# EAGLE schematic people_counter_v2 (EAGLE 9.6.2)

## Sheet 1 of 2
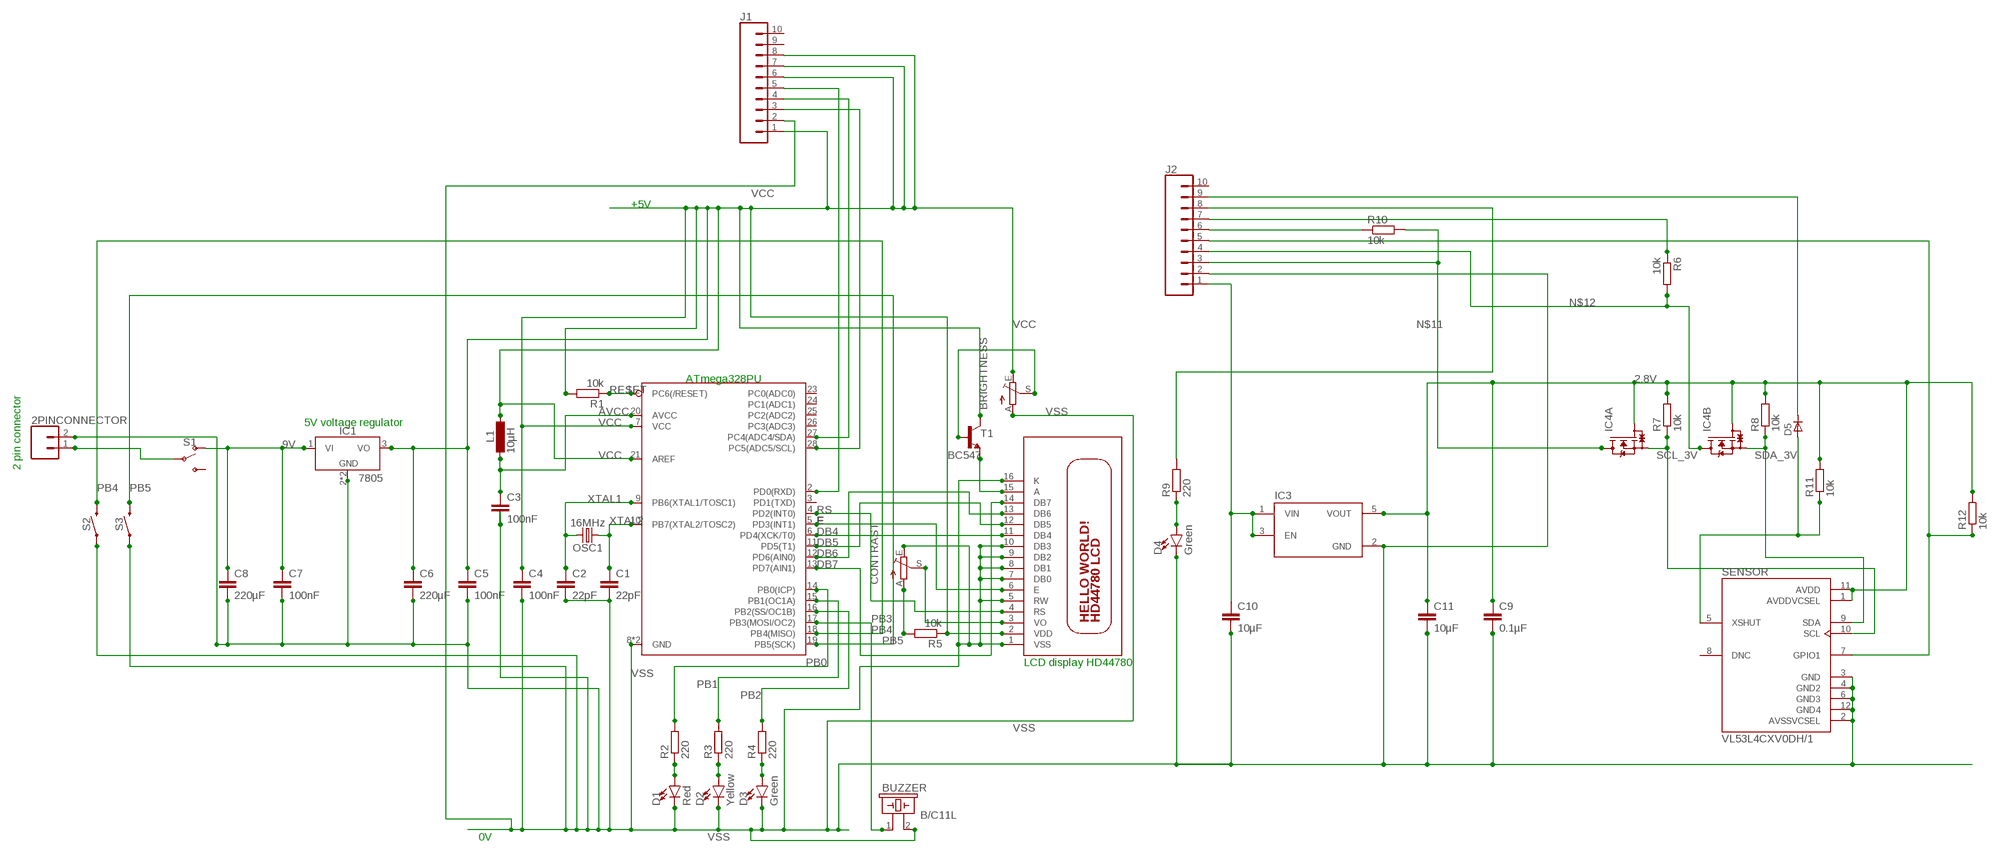
[diagram p0: schematic, sheet 1]

### Parts
2PINCONNECTOR  CONN_02  [1X02]
BRIGHTNESS  TRIM_EU-PT10S  [PT-10S]
BUZZER  B/C11L  [B/C11L]
C1  22pF  C-EUC0805  [C0805]
C2  22pF  C-EUC0805  [C0805]
C3  100nF  C-EUC0805  [C0805]
C4  100nF  C-EUC0805  [C0805]
C5  100nF  C-EUC0805  [C0805]
C6  220µF  C-EUC0805  [C0805]
C7  100nF  C-EUC0805  [C0805]
C8  220µF  C-EUC0805  [C0805]
C9  0.1µF  C-EUC0805  [C0805]
C10  10µF  C-EUC0805  [C0805]
C11  10µF  C-EUC0805  [C0805]
CONTRAST  TRIM_EU-PT10S  [PT-10S]
D1  Red  LED-RED-0603-WE  [LED-0603]
D2  Yellow  LED-YELLOW-0603-WE  [LED-0603]
D3  Green  LED-GREEN-0603-WE  [LED-0603]
D4  Green  LED-GREEN-0603-WE  [LED-0603]
D5  1N4148WS  [SOD323F]
IC1  7805  LM7805_SOT223  [SOT230P700X170-4]
IC2  328P  ATMEGA328P_PDIP  [DIP28]
IC3  MIC5504-2.8YM5-TR  [SOT95P280X145-5N]
IC4  DMN63D8LDW-7  [SOT363]
J1  CONN_10"  [1X10]
J2  CONN_10"  [1X10]
L1  10µH  L-EUL1812  [L1812]
OSC1  16MHz  CRYSTAL-16MHZPTH-HC49US  [HC49US]
R1  10k  R-EU_R0603  [R0603]
R2  220  R-EU_R0603  [R0603]
R3  220  R-EU_R0603  [R0603]
R4  220  R-EU_R0603  [R0603]
R5  10k  R-EU_R0603  [R0603]
R6  10k  R-EU_R0603  [R0603]
R7  10k  R-EU_R0603  [R0603]
R8  10k  R-EU_R0603  [R0603]
R9  220  R-EU_R0603  [R0603]
R10  10k  R-EU_R0603  [R0603]
R11  10k  R-EU_R0603  [R0603]
R12  10k  R-EU_R0603  [R0603]
S1  SWITCH-SPDT-PTH-11.6X4.0MM  [SWITCH_SPDT_PTH_11.6X4.0MM]
S2  MOMENTARY-SWITCH-SPST-PTH-6.0MM  [TACTILE_SWITCH_PTH_6.0MM]
S3  MOMENTARY-SWITCH-SPST-PTH-6.0MM  [TACTILE_SWITCH_PTH_6.0MM]
SENSOR  VL53L4CXV0DH/1  [XCDR_VL53L4CXV0DH/1]
T1  BC547  [TO92]
X1  HD44780LCD-1602  [LCD1602]

### Nets
2.8V [New Class]: C9.1 C11.1 IC3.5(VOUT) IC4.G1(A:G) IC4.G2(B:G) R7.2 R8.2 R11.2 R12.2 SENSOR.1(AVDDVCSEL) SENSOR.11(AVDD)
9V: C7.1 C8.1 IC1.1(VI) S1.1(O)
AVCC: C3.1 IC2.20(AVCC) L1.2
DB4: IC2.6(PD4(XCK/T0)) X1.11(DB4)
DB5: IC2.11(PD5(T1)) X1.12(DB5)
DB6: IC2.12(PD6(AIN0)) X1.13(DB6)
DB7: IC2.13(PD7(AIN1)) X1.14(DB7)
E: IC2.5(PD3(INT1)) X1.6(E)
GREEN: D3.A R4.1
N$1: J2.6 R10.1
N$2: D4.A R9.1
N$3: D5.C J2.9
N$4: 2PINCONNECTOR.1 S1.2(P)
N$5: IC2.2(PD0(RXD)) J1.5
N$7 [New Class]: D5.A R11.1 SENSOR.5(XSHUT)
N$8: CONTRAST.A R5.2
N$10 [New Class]: J2.5 R12.1 SENSOR.7(GPIO1)
N$11 [New Class]: IC4.D1(A:D) J2.3 R10.2
N$12 [New Class]: IC4.D2(B:D) J2.4 R6.2
N$13: BRIGHTNESS.S T1.2(B)
N$14: J2.8 R9.2
N$15: J2.7 R6.1
N$16 [New Class]: C10.1 IC3.1(VIN) IC3.3(EN) J2.1
N$23: T1.1(E) X1.15(A)
PB0: IC2.14(PB0(ICP)) R2.2
PB1: IC2.15(PB1(OC1A)) R3.2
PB2: IC2.16(PB2(SS/OC1B)) R4.2
PB3: BUZZER.1 IC2.17(PB3(MOSI/OC2))
PB4: IC2.18(PB4(MISO)) S2.3
PB5: IC2.19(PB5(SCK)) S3.3
RED: D1.A R2.1
RESET: IC2.1(PC6(/RESET)) R1.1
RS: IC2.4(PD2(INT0)) X1.4(RS)
SCL_3V [New Class]: IC4.S1(A:S) R7.1 SENSOR.10(SCL)
SCL_5V: IC2.28(PC5(ADC5/SCL)) J1.3
SDA_3V [New Class]: IC4.S2(B:S) R8.1 SENSOR.9(SDA)
SDA_5V: IC2.27(PC4(ADC4/SDA)) J1.4
VCC: BRIGHTNESS.E C4.1 C5.1 C6.1 IC1.3(VO) IC2.7(VCC) IC2.21(AREF) J1.1 J1.6 J1.7 J1.8 L1.1 R1.2 R5.1 T1.3(C) X1.2(VDD)
VO: CONTRAST.S X1.3(VO)
VSS [New Class]: 2PINCONNECTOR.2 BRIGHTNESS.A BUZZER.2 C1.2 C2.2 C3.2 C4.2 C5.2 C6.2 C7.2 C8.2 C9.2 C10.2 C11.2 CONTRAST.E D1.C D2.C D3.C D4.C IC1.2(GND) IC1.4(GND) IC2.8(GND) IC2.22(GND) IC3.2(GND) J1.2 J2.2 S2.1 S3.1 SENSOR.2(AVSSVCSEL) SENSOR.3(GND) SENSOR.4(GND2) SENSOR.6(GND3) SENSOR.12(GND4) X1.1(VSS) X1.5(RW) X1.7(DB0) X1.8(DB1) X1.9(DB2) X1.10(DB3) X1.16(K)
XTAL1: C2.1 IC2.9(PB6(XTAL1/TOSC1)) OSC1.2
XTAL2: C1.1 IC2.10(PB7(XTAL2/TOSC2)) OSC1.1
YELLOW: D2.A R3.1
Unconnected: IC2.3(PD1(TXD)) IC2.23(PC0(ADC0)) IC2.24(PC1(ADC1)) IC2.25(PC2(ADC2)) IC2.26(PC3(ADC3)) J1.9 J1.10 J2.10 S1.3(S) SENSOR.8(DNC)

### Notes on the sheet
- +5V
- ATmega328PU
- 5V voltage regulator
- 2 pin connector
- LCD display HD44780
- 0V

## Sheet 2 of 2

## Library data of the parts
2PINCONNECTOR = SparkFun-Connectors:CONN_02: Multi connection point. Often used as Generic Header-pin footprint for 0.1 inch spaced/style header connections On any of the 0.1 inch spaced packages, you can populate with these: Break Away Headers - Straight <https://www.sparkfun.com/products/116> (PRT-00116) Break Away Male Headers - Right Angle <https://www.sparkfun.com/products/553> (PRT-00553) Female Headers <https://www.sparkfun.com/products/115> (PRT-00115) Break Away Headers - Machine Pin <https://www.sparkfun.com/products/117> (PRT-00117) Break Away Female Headers - Swiss Machine Pin <https://www.sparkfun.com/products/743> (PRT-00743) For SCREWTERMINALS and SPRING TERMINALS visit here: Screw Terimnals on SparkFun.com <https://www.sparkfun.com/search/results?term=Screw+Terminals> (5mm/3.5mm/2.54mm spacing) This device is also useful as a general connection point to wire up your design to another part of your project. Our various solder wires solder well into these plated through hole pads. Hook-Up Wire - Assortment (Stranded, 22 AWG) <https://www.sparkfun.com/products/11375> (PRT-11375) Hook-Up Wire - Assortment (Solid Core, 22 AWG) <https://www.sparkfun.com/products/11367> (PRT-11367) View the entire wire category on our website here <https://www.sparkfun.com/categories/141> Special notes: Molex polarized connector foot print use with: PRT-08233 with associated crimp pins and housings. 2.54_SCREWTERM for use with PRT-10571. 3.5mm Screw Terminal footprints for PRT-08084 5mm Screw Terminal footprints for use with PRT-08432
BRIGHTNESS CONTRAST = pot:TRIM_EU-: POTENTIOMETER
BUZZER = buzzer:B/C11L: BUZZER Source: Buerklin; OC_FARNELL: unknown; OC_NEWARK: unknown
C1-C11 = rcl:C-EU: CAPACITOR, European symbol; SPICEPREFIX: C
D1 = SparkFun-LED:LED-RED: Red SMD LED Used in manufacturing of most products at SparkFun Packages: 0603 - KB - KingBright (DIO-17976) SMD 0603 package [Datasheet] <https://www.kingbrightusa.com/images/catalog/SPEC/APT1608SURCK.pdf> 0603 - (DIO-00819, has gone EOL) SMD 0603 package 0603 SMART - SMD 0603 SMART package ( more efficient and expensive)[Product Link] <http://www.osram-os.com/Graphics/XPic2/00077099_0.pdf> 1206 - SMD1206 package [Product Link] <https://www.sparkfun.com/datasheets/DevTools/LilyPad/Q150OVS4.pdff> SparkFun Products: Pro Mini 328 -5V <https://www.sparkfun.com/products/821> RedBoard <https://www.sparkfun.com/products/12757> IOIO-OTG <https://www.sparkfun.com/products/13613>; PROD_ID: DIO-16511
D2 = SparkFun-LED:LED-YELLOW: Yellow SMD LED Used in manufacturing several products at SparkFun. Packages: 0603 - SMD 0603 package[Product Link] <http://www.kingbrightusa.com/product.asp?catalog_name=LED&product_id=APT1608SYCK> 0603 -SMART - SMART SMD 0603 package (more efficient/more expensive) [Product Link] <http://www.osram-os.com/osram_os/en/products/product-catalog/led-light-emitting-diodes/smartled-0603/ly-l29k/index.jsp> LilyPad - SMD1206 package[Product Datasheet] <https://www.sparkfun.com/datasheets/DevTools/LilyPad/Q150YUS4.pdf> SparkFun Products: Blynk Board <https://www.sparkfun.com/products/13794> IOIO-OTG <https://www.sparkfun.com/products/13613> XBee Explorer Serial <https://www.sparkfun.com/products/13225>; PROD_ID: DIO-16514
D3 D4 = SparkFun-LED:LED-GREEN: Green SMD LED Used in manufacturing of various products at SparkFun Packages: 0603 - SMD 0603 package [Product Link] <http://www.futureelectronics.com/en/technologies/semiconductors/optoelectronics/leds/Pages/9894312-LTST-C190GKT.aspx?CrossPart=HSMG-C190&IM=0> LilyPad 1206 - SMD1206 LilyPad package [Product Link] <http://www.futureelectronics.com/en/Technologies/Product.aspx?ProductID=IN150NGHARVATEKCORPORATION2049943&IM=0> 1206 - SMD1206 package [Product Link] <http://www.futureelectronics.com/en/technologies/semiconductors/optoelectronics/leds/Pages/8315665-LTST-C150KGKT.aspx?IM=0> 1206 Bottom Mount -SMD 1206 Bottom Mount [Product Link] <http://www.digikey.com/product-detail/en/lite-on-inc/LTST-C230KGKT/160-1456-1-ND/386854> SparkFun Products: Pro Mini 328 -5V <https://www.sparkfun.com/products/821> RedBoard <https://www.sparkfun.com/products/12757> MP3 Trigger <https://www.sparkfun.com/products/13720> Makey Makey <https://www.sparkfun.com/products/11076>; PROD_ID: DIO-16512
D5 = _hhn_diodes_smd:1N4148WS: 1N4148 General Purpose Rectifie SMD-Version of 1N4148 Case: SOD 323 F Author: Dipl.-Ing. FH Rainer Bayer HHN Hochschule Heilbronn, rainer.bayer@hs-heilbronn.de Ingenieurbüro ing-rb, mail@ing-rb.de
IC1 = IC_Power-Management:LM7805: 5V Voltage Regulator Reference Datasheet <https://www.ti.com/lit/ds/symlink/lm340.pdf>; CATEGORY: IC_Logic; DESCRIPTION: 5V Voltage Regulator; MANUFACTURER: Generic; MPN: Generic; SERIES: LM7805; SUB-CATEGORY: Voltage Regulator; TYPE: 5V
IC2 = SparkFun-IC-Microcontroller:ATMEGA328P_PDIP: Atmel 328P Through hole ATMEGA328P uC used in the Arduino 32kb flash, 1k EEPROM, 2k SRAM Datasheet <http://www.sparkfun.com/datasheets/Components/SMD/ATMega328.pdf> SparkFun Products Storefront component: AVR 28 Pin 20MHz 32K 6A/D - ATMega328P <https://www.sparkfun.com/products/9061> (COM-09061) SparkFun Simon Says - Through-Hole Soldering Kit <https://www.sparkfun.com/products/10547> (KIT-10547) SparkFun Learn to Solder - Simon Says <https://www.sparkfun.com/products/13708> (KIT-13708) SparkFun BigTime Watch Kit <https://www.sparkfun.com/products/11734> (KIT-11734) SparkFun ClockIt <https://www.sparkfun.com/products/10930> (KIT-10930) SparkFun Serial Enabled LCD Kit <https://www.sparkfun.com/products/10097> (LCD-10097) SparkFun Simon Tilts - Through Hole Soldering Kit <https://www.sparkfun.com/products/12634> (KIT-12634) SparkFun Frequency Counter Kit <https://www.sparkfun.com/products/10140> (KIT-10140) FabFM Radio Kit <https://www.sparkfun.com/products/11043> (KIT-11043) SparkFun Binary Blaster Kit <https://www.sparkfun.com/products/12037> (KIT-12037) SparkFun Metro-Gnome <https://www.sparkfun.com/products/9236> (KIT-09236) ATmega328 with Arduino Optiboot (Uno) <https://www.sparkfun.com/products/10524> (DEV-10524); PROD_ID: IC-09136
IC3 = MIC5504-2.8YM5-TR:MIC5504-2.8YM5-TR: Linear Voltage Regulator IC 1 Output 300mA SOT-23-5 Check availability <https://pricing.snapeda.com/parts/MIC5504-2.8YM5-TR/Microchip/view-part?ref=eda>; AVAILABILITY: In Stock; CHECK_PRICES: https://www.snapeda.com/parts/MIC5504-2.8YM5-TR/Microchip/view-part/?ref=eda; DESCRIPTION: Linear Voltage Regulator IC Positive Fixed 1 Output 300mA SOT-23-5; MF: Microchip; MP: MIC5504-2.8YM5-TR; PACKAGE: SOT-23 Microchip; PRICE: None; SNAPEDA_LINK: https://www.snapeda.com/parts/MIC5504-2.8YM5-TR/Microchip/view-part/?ref=snap
IC4 = DMN63D8LDW-7:DMN63D8LDW-7: Dual MOSFET 2N-CH 30V 220MA SOT363 Check availability <https://pricing.snapeda.com/parts/DMN63D8LDW-7/Diodes%20Inc./view-part?ref=eda>; AVAILABILITY: In Stock; CHECK_PRICES: https://www.snapeda.com/parts/DMN63D8LDW-7/Diodes+Inc./view-part/?ref=eda; DESCRIPTION: Dual N-Ch Enhancement MOSFET SOT-363 | Diodes Inc DMN63D8LDW-7; MF: Diodes Inc.; MP: DMN63D8LDW-7; PACKAGE: SOT-363 Diodes Inc.; PRICE: None; SNAPEDA_LINK: https://www.snapeda.com/parts/DMN63D8LDW-7/Diodes+Inc./view-part/?ref=snap
J1 J2 = SparkFun-Connectors:CONN_10: Multi connection point. Often used as Generic Header-pin footprint for 0.1 inch spaced/style header connections On any of the 0.1 inch spaced packages, you can populate with these: Break Away Headers - Straight <https://www.sparkfun.com/products/116> (PRT-00116) Break Away Male Headers - Right Angle <https://www.sparkfun.com/products/553> (PRT-00553) Female Headers <https://www.sparkfun.com/products/115> (PRT-00115) Break Away Headers - Machine Pin <https://www.sparkfun.com/products/117> (PRT-00117) Break Away Female Headers - Swiss Machine Pin <https://www.sparkfun.com/products/743> (PRT-00743) Arduino Stackable Header - 10 Pin <https://www.sparkfun.com/products/11376> (PRT-11376) For SCREWTERMINALS and SPRING TERMINALS visit here: Screw Terimnals on SparkFun.com <https://www.sparkfun.com/search/results?term=Screw+Terminals> (5mm/3.5mm/2.54mm spacing) This device is also useful as a general connection point to wire up your design to another part of your project. Our various solder wires solder well into these plated through hole pads. Hook-Up Wire - Assortment (Stranded, 22 AWG) <https://www.sparkfun.com/products/11375> (PRT-11375) Hook-Up Wire - Assortment (Solid Core, 22 AWG) <https://www.sparkfun.com/products/11367> (PRT-11367) View the entire wire category on our website here <https://www.sparkfun.com/categories/141> Special notes: Molex polarized connector foot print use with SKU : PRT-08231 with associated crimp pins and housings. 1MM SMD Version SKU: PRT-10208 NOTES ON THE VARIANTS LOCK and LOCK_LONGPADS... This footprint was designed to help hold the alignment of a through-hole component (i.e. 6-pin header) while soldering it into place. You may notice that each hole has been shifted either up or down by 0.005 of an inch from it's more standard position (which is a perfectly straight line). This slight alteration caused the pins (the squares in the middle) to touch the edges of the holes. Because they are alternating, it causes a "brace" to hold the component in place. 0.005 has proven to be the perfect amount of "off-center" position when using our standard breakaway headers. Although looks a little odd when you look at the bare footprint, once you have a header in there, the alteration is very hard to notice. Also,if you push a header all the way into place, it is covered up entirely on the bottom side.; PROD_ID: CONN-11563
L1 = rcl:L-EU: INDUCTOR, European symbol; SPICEPREFIX: L
OSC1 = SparkFun-Clocks:CRYSTAL-16MHZ: 16MHz Crystal Digikey Example <http://www.digikey.com/product-search/en?keywords=535-9122-1-ND> Frequency: 16MHz Frequency Stability: ±50ppm Frequency Tolerance: ±20ppm Load Capacitance: 18pF SparkFun Products: Pro Micro -5V/16MHz <https://www.sparkfun.com/products/12640> SparkFun Serial Enabled LCD Kit <https://www.sparkfun.com/products/10097>; PROD_ID: XTAL-08181; SF_ID: COM-00536
R1-R12 = rcl:R-EU_: RESISTOR, European symbol; SPICEPREFIX: R
S1 = SparkFun-Switches:SWITCH-SPDT: Single Pole, Double Throw (SPDT) Switch Single-pole, double-throw (SPDT) switch. Variant Overview SMD-AYZ0202 Surface Mount DPDT Switch <https://www.sparkfun.com/products/597> (COM-00597) Used on e.g. LilyPad Arduino USB - ATmega32U4 Board <https://www.sparkfun.com/products/12049> PTH-11.6X4.0MM SPDT Mini Power Switch <https://www.sparkfun.com/products/102> (COM-00102) Used on e.g. SparkFun Simon Says - Through-Hole Soldering Kit <https://www.sparkfun.com/products/10547> (KIT-10547) PTH-11.6X4.0MM-KIT KIT version of SPDT Mini Power Switch - Simplifies soldering by removing tStop of switch pins - only one side can be soldered. PTH-11.6X4.0MM-LOCK LOCK version of SPDT Mini Power Switch - Offset pins hold switch in place for easier soldering. SMD-RIGHT-ANGLE Surface Mount Right Angle Switch <https://www.sparkfun.com/products/10860> (COM-10860) Used on e.g. SparkFun ESP8266 Thing <https://www.sparkfun.com/products/13231>; PROD_ID: SWCH-08261; SF_SKU: COM-00102
S2 S3 = SparkFun-Switches:MOMENTARY-SWITCH-SPST: Momentary Switch (Pushbutton) - SPST Normally-open (NO) SPST momentary switches (buttons, pushbuttons). Variants PTH-12MM - 12mm square, through-hole Momentary Pushbutton Switch - 12mm Square <https://www.sparkfun.com/products/9190> (COM-09190) PTH-6.0MM, PTH-6.0MM-KIT - 6.0mm square, through-hole Mini Pushbutton Switch <https://www.sparkfun.com/products/97> (COM-00097) KIT package intended for soldering kit's - only one side of pads' copper is exposed. PTH-RIGHT-ANGLE-KIT - Right-angle, through-hole Right Angle Tactile Button <https://www.sparkfun.com/products/10791> - Used on SparkFun BigTime Watch Kit <https://www.sparkfun.com/products/11734> SMD-12MM - 12mm square, surface-mount Tactile Button - SMD (12mm) <https://www.sparkfun.com/products/12993> (COM-12993) Used on SparkFun PicoBoard <https://www.sparkfun.com/products/11888> SMD-4.5MM - 4.5mm Square Trackball Switch Used on SparkFun Blackberry Trackballer Breakout <https://www.sparkfun.com/products/13169> SMD-4.6MMX2.8MM - 4.60mm x 2.80mm, surface mount Used on SparkFun Pro Micro - RP2040 <https://www.sparkfun.com/products/17717> SMD-5.2MM, SMD-5.2-REDUNDANT - 5.2mm square, surface-mount Mini Pushbutton Switch - SMD <https://www.sparkfun.com/products/8720> (COM-08720) Used on Arduino Pro Mini <https://www.sparkfun.com/products/11114> REDUNDANT package connects both switch circuits together SMD-6.0X3.5MM - 6.0 x 3.5mm, surface mount Momentary Reset Switch SMD <https://www.sparkfun.com/products/8229> (COM-08229) SMD-6.2MM-TALL - 6.2mm square, surface mount Tactile Button - SMD (6mm) <https://www.sparkfun.com/products/12992> Used on SparkFun Digital Sandbox <https://www.sparkfun.com/products/12651> SMD-RIGHT-ANGLE - Right-angle, surface mount Used on SparkFun Block for Intel® Edison - Arduino <https://www.sparkfun.com/products/13036>; PROD_ID: SWCH-08441; SF_SKU: COM-00097
SENSOR = VL53L4CXV0DH_1:VL53L4CXV0DH/1: Check availability <https://pricing.snapeda.com/parts/VL53L4CXV0DH/1/STMicroelectronics/view-part?ref=eda>; AVAILABILITY: In Stock; CHECK_PRICES: https://www.snapeda.com/parts/VL53L4CXV0DH/1/STMicroelectronics/view-part/?ref=eda; DESCRIPTION: Proximity Sensor Time of Flight(TOF) 600cm 2.6V to 3.5VDC 12-Pin LGA T/R; MF: STMicroelectronics; MP: VL53L4CXV0DH/1; PACKAGE: None; PRICE: None; SNAPEDA_LINK: https://www.snapeda.com/parts/VL53L4CXV0DH/1/STMicroelectronics/view-part/?ref=snap
T1 = transistor:BC547: NPN TRANSISTOR
X1 = adafruit:HD44780LCD: HD44780 LCD Standard character type LCDs, available in sizes from 8x1 to 40x4!

## Net classes
0 default: clearance 0.5 mm
1 New Class: clearance 0.2 mm